# EAGLE design SMRT_CLK (EAGLE 9.3.0)
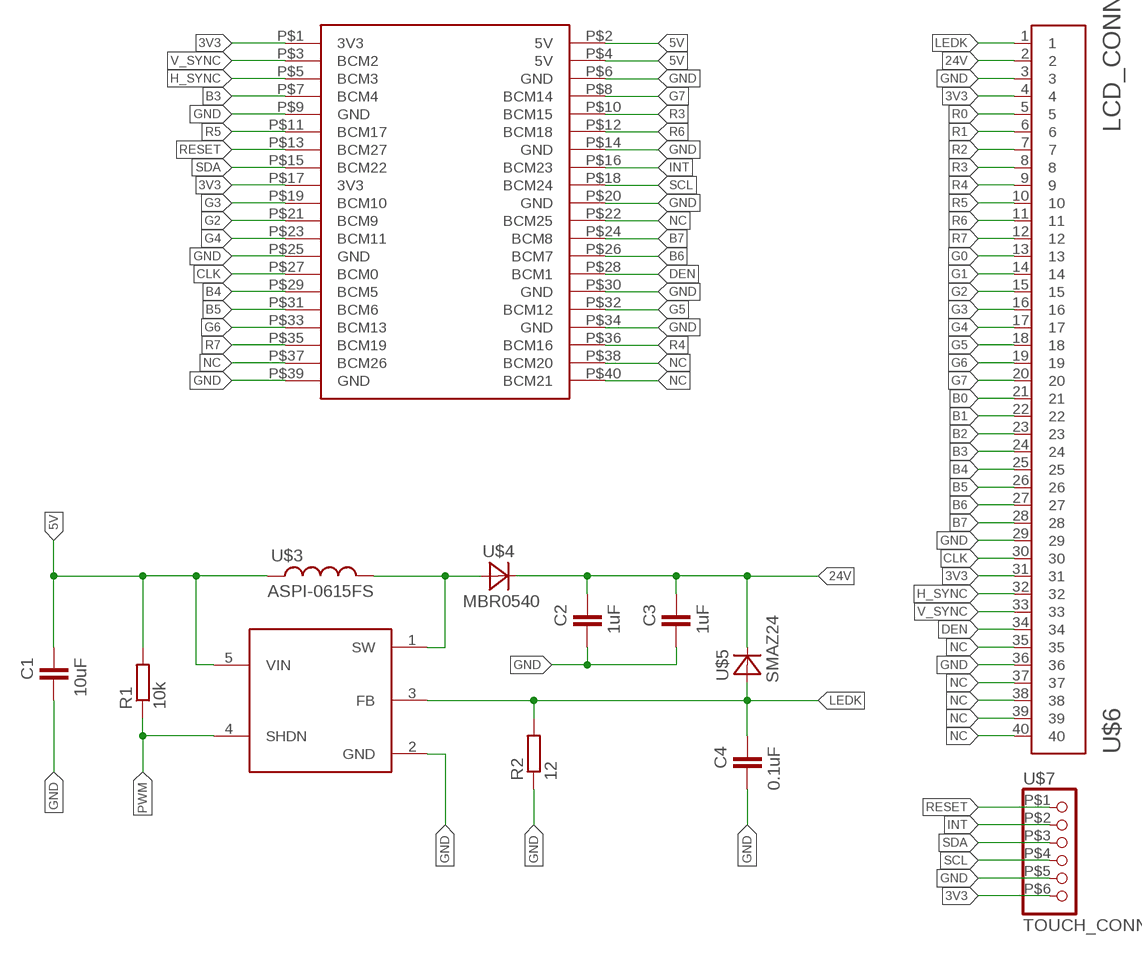
[diagram p0: schematic, sheet 1]

## Parts
C1  10uF  C-EUC0805  [C0805]
C2  1uF  C-EUC0805  [C0805]
C3  1uF  C-EUC0805  [C0805]
C4  0.1uF  C-EUC0805  [C0805]
R1  10k  R-EU_R0805  [R0805]
R2  12  R-EU_R0805  [R0805]
U$1  SMRT_CLK  [FULL_BOARD]
U$2  FAN5333BSX  [SOT23-5]
U$3  ASPI-0615FS  [CUST_IND]
U$4  MBR0540  [SOD-123_MINI-SMA]
U$5  SMAZ24  [DO-214AC]
U$6  LCD_CONN  [4-1734839-0]
U$7  TOUCH_CONN  [052207]

## Nets
3V3: U$1.P$1(3V3) U$1.P$17(3V3) U$6.4 U$6.31 U$7.P$6
5V: C1.2 R1.2 U$1.P$2(5V) U$1.P$4(5V) U$2.5(VIN) U$3.P$1
24V: C2.2 C3.2 U$4.C U$5.C U$6.2
B0: U$6.21
B1: U$6.22
B2: U$6.23
B3: U$1.P$7(BCM4) U$6.24
B4: U$1.P$29(BCM5) U$6.25
B5: U$1.P$31(BCM6) U$6.26
B6: U$1.P$26(BCM7) U$6.27
B7: U$1.P$24(BCM8) U$6.28
CLK: U$1.P$27(BCM0) U$6.30
DEN: U$1.P$28(BCM1) U$6.34
G0: U$6.13
G1: U$6.14
G2: U$1.P$21(BCM9) U$6.15
G3: U$1.P$19(BCM10) U$6.16
G4: U$1.P$23(BCM11) U$6.17
G5: U$1.P$32(BCM12) U$6.18
G6: U$1.P$33(BCM13) U$6.19
G7: U$1.P$8(BCM14) U$6.20
GND: C1.1 C2.1 C3.1 C4.1 R2.1 U$1.P$6(GND) U$1.P$9(GND) U$1.P$14(GND) U$1.P$20(GND) U$1.P$25(GND) U$1.P$30(GND) U$1.P$34(GND) U$1.P$39(GND) U$2.2(GND) U$6.3 U$6.29 U$6.36 U$7.P$5
H_SYNC: U$1.P$5(BCM3) U$6.32
INT: U$1.P$16(BCM23) U$7.P$2
LEDK: C4.2 R2.2 U$2.3(FB) U$5.A U$6.1
N$1: U$2.1(SW) U$3.P$2 U$4.A
NC: U$1.P$22(BCM25) U$1.P$37(BCM26) U$1.P$38(BCM20) U$1.P$40(BCM21) U$6.35 U$6.37 U$6.38 U$6.39 U$6.40
PWM: R1.1 U$2.4(SHDN)
R0: U$6.5
R1: U$6.6
R2: U$6.7
R3: U$1.P$10(BCM15) U$6.8
R4: U$1.P$36(BCM16) U$6.9
R5: U$1.P$11(BCM17) U$6.10
R6: U$1.P$12(BCM18) U$6.11
R7: U$1.P$35(BCM19) U$6.12
RESET: U$1.P$13(BCM27) U$7.P$1
SCL: U$1.P$18(BCM24) U$7.P$4
SDA: U$1.P$15(BCM22) U$7.P$3
V_SYNC: U$1.P$3(BCM2) U$6.33

## Library data of the parts
C1-C4 = rcl:C-EU: CAPACITOR, European symbol; SPICEPREFIX: C
R1 R2 = resistor:R-EU_: RESISTOR, European symbol
U$1 = rpi_zero_w:SMRT_CLK
U$2 = screen_parts:FAN5333BSX
U$3 = screen_parts:ASPI-0615FS
U$4 = screen_parts:MBR0540
U$5 = screen_parts:SMAZ24
U$6 = screen_parts:LCD_CONN
U$7 = screen_parts:TOUCH_CONN

## Board
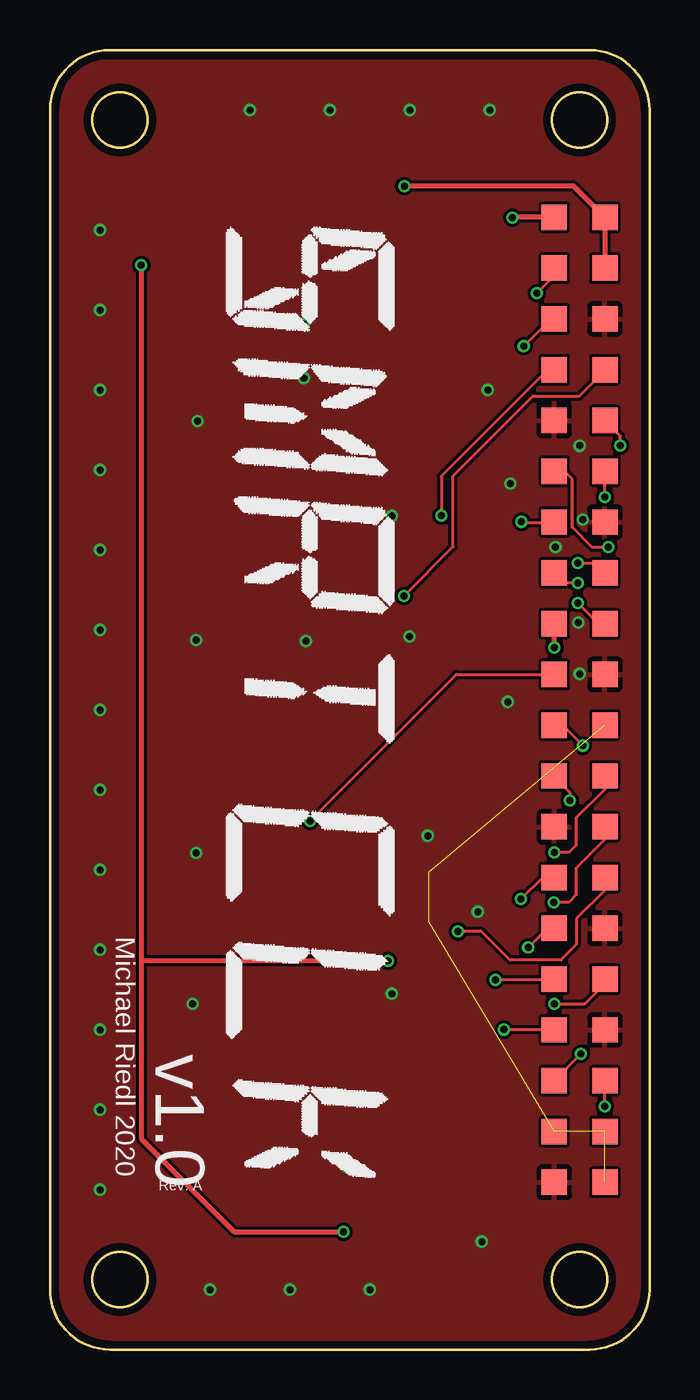
[diagram p1: board, top side]
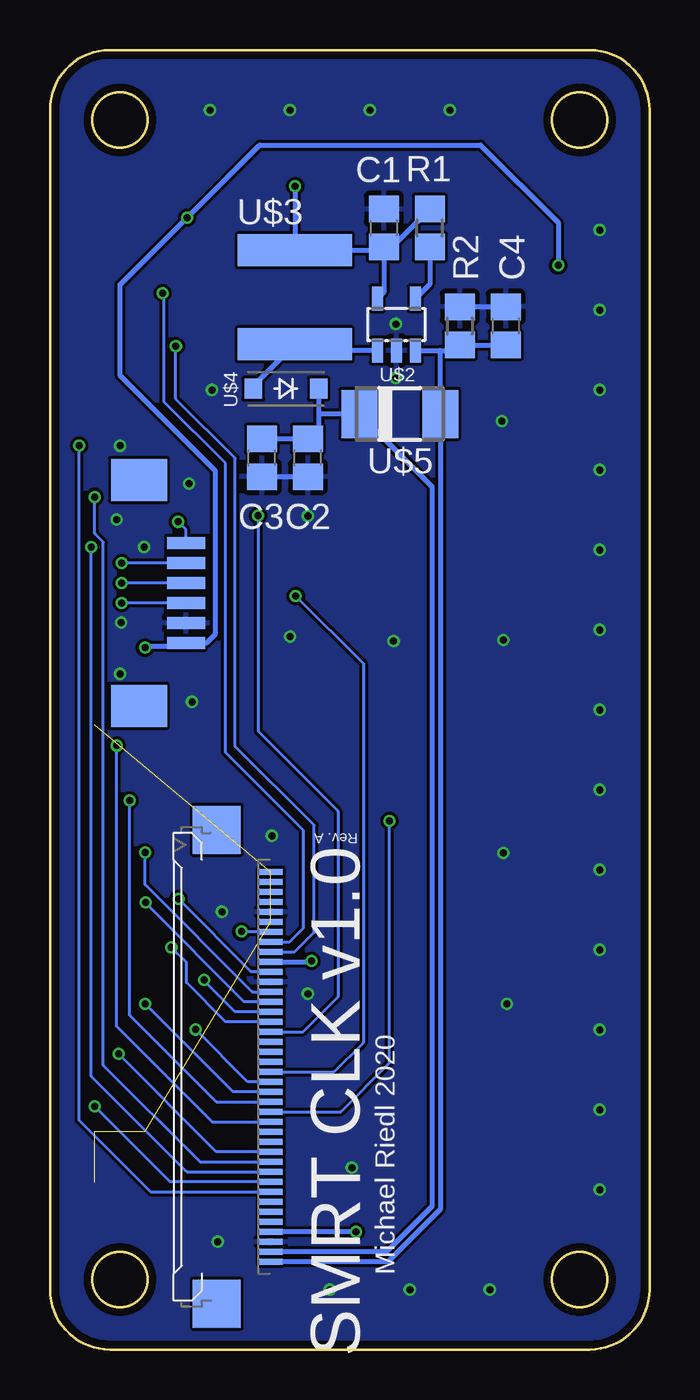
[diagram p2: board, bottom side, seen from below]

Size 30 x 65 mm. Coordinates in mm from the lower left corner, seen from the top.
Copper layers (1*16): Top 0.035559375mm / dielectric 1.6mm / Bottom 0.035559375mm
Design rules "default": minimum track width 6mil, minimum drill 10mil, track to track 6mil, track to pad 6mil, pad to pad 6mil, via to via 6mil, smd to smd 6mil, copper to edge 15mil, drill to drill 6mil, minimum pad ring 5mil, minimum via ring 5mil, stop-mask expansion 2.5mil, vias tented up to drill 15mil, thermal gap 10mil

### Footprints (pad centres in the part's own frame; a part is rotated, then mirrored left to right if it is on the bottom)
C0805 = smd 1.3 x 1.5: 1 -0.95,0; 2 0.95,0
R0805 = smd 1.3 x 1.5: 1 -0.95,0; 2 0.95,0
FULL_BOARD = smd 1.27 x 1.27: P$1 -24.13,10.23; P$2 -24.13,12.77; P$3 -21.59,10.23; P$4 -21.59,12.77; P$5 -19.05,10.23; P$6 -19.05,12.77; P$7 -16.51,10.23; P$8 -16.51,12.77; P$9 -13.97,10.23; P$10 -13.97,12.77; P$11 -11.43,10.23; P$12 -11.43,12.77; P$13 -8.89,10.23; P$14 -8.89,12.77; P$15 -6.35,10.23; P$16 -6.35,12.77; P$17 -3.81,10.23; P$18 -3.81,12.77; P$19 -1.27,10.23; P$20 -1.27,12.77; P$21 1.27,10.23; P$22 1.27,12.77; P$23 3.81,10.23; P$24 3.81,12.77; P$25 6.35,10.23; P$26 6.35,12.77; P$27 8.89,10.23; P$28 8.89,12.77; P$29 11.43,10.23; P$30 11.43,12.77; P$31 13.97,10.23; P$32 13.97,12.77; P$33 16.51,10.23; P$34 16.51,12.77; P$35 19.05,10.23; P$36 19.05,12.77; P$37 21.59,10.23; P$38 21.59,12.77; P$39 24.13,10.23; P$40 24.13,12.77
SOT23-5 = smd 0.55 x 1.2: 1 -0.95,-1.3; 2 0,-1.3; 3 0.95,-1.3; 4 0.95,1.3; 5 -0.95,1.3
CUST_IND = smd 1.6 x 5.7: P$1 -2.35,0; P$2 2.35,0
SOD-123_MINI-SMA = smd 0.88 x 1.02: A 1.635,0; C -1.635,0
DO-214AC = smd 1.8 x 2.4: A 2.025,0; C -2.025,0
4-1734839-0 = smd 0.3 x 1.2: 1 -9.75,-2.54; 2 -9.25,-2.54; 3 -8.75,-2.54; 4 -8.25,-2.54; 5 -7.75,-2.54; 6 -7.25,-2.54; 7 -6.75,-2.54; 8 -6.25,-2.54; 9 -5.75,-2.54; 10 -5.25,-2.54; 11 -4.75,-2.54; 12 -4.25,-2.54; 13 -3.75,-2.54; 14 -3.25,-2.54; 15 -2.75,-2.54; 16 -2.25,-2.54; 17 -1.75,-2.54; 18 -1.25,-2.54; 19 -0.75,-2.54; 20 -0.25,-2.54; 21 0.25,-2.54; 22 0.75,-2.54; 23 1.25,-2.54; 24 1.75,-2.54; 25 2.25,-2.54; 26 2.75,-2.54; 27 3.25,-2.54; 28 3.75,-2.54; 29 4.25,-2.54; 30 4.75,-2.54; 31 5.25,-2.54; 32 5.75,-2.54; 33 6.25,-2.54; 34 6.75,-2.54; 35 7.25,-2.54; 36 7.75,-2.54; 37 8.25,-2.54; 38 8.75,-2.54; 39 9.25,-2.54; 40 9.75,-2.54 | smd 2.4 x 2.4: M1 11.85,0.16; M2 -11.85,0.16
052207 = smd 0.6 x 1.9: P$1 -2.5,0; P$2 -1.5,0; P$3 -0.5,0; P$4 0.5,0; P$5 1.5,0; P$6 2.5,0 | smd 2.1 x 2.8: P$7 -5.65,-2.35; P$8 5.65,-2.35

### Placement (x,y rotation side)
C1  13.3,56.1 270 bottom
C2  17.1,44.6 90 bottom
C3  19.4,44.6 90 bottom
C4  7.2,51.2 270 bottom
R1  11,56.1 90 bottom
R2  9.5,51.2 270 bottom
U$1  15,32.5 270 top
U$2  12.67,51.27 0 bottom
U$3  17.75,52.63 270 bottom
U$4  18.19,48.06 180 bottom
U$5  12.5,46.8 0 bottom
U$6  21.5,14.15 90 bottom
U$7  23.2,37.85 270 bottom

### Tracks (layer width: path | path; a pad name or v marks a point on that pad's centre or on a via)
3V3  (via drill 0.35)
  Top 0.254: U$1.P$1 23.15,56.63 v23.14,56.62 | v14.68,5.89 9.22,5.89 4.57,10.54 4.57,19.41 | U$1.P$17 25.2,36.28 25.25,36.23 v25.25,35.1 | v4.57,54.23 4.57,19.41 | v16.92,19.43 4.6,19.43 4.57,19.41
  Bottom 0.254: v14.68,5.89 U$6.4 | v4.57,54.23 4.57,56.36 8.46,60.25 19.51,60.25 v23.14,56.62 26.49,53.27 26.49,48.72 21.74,43.97 21.74,35.76 22.16,35.34 23.19,35.34 U$7.P$6 23.37,35.18 25.17,35.18 v25.25,35.1 | U$6.31 16.95,19.4 v16.92,19.43
5V  (via drill 0.35)
  Top 0.254: v17.73,58.19 26.21,58.19 U$1.P$2 U$1.P$4
  Bottom 0.254: v17.73,58.19 17.73,55 U$3.P$1 13.47,54.98 C1.2 | C1.2 12.9,55.15 R1.2 | C1.2 13.3,52.89 U$2.5
24V
  Bottom 0.254: U$4.C 16.55,46.71 | 16.55,46.71 16.55,46.09 C2.2 C3.2 | 16.55,46.71 16.47,46.8 U$5.C 10.88,43.16 10.88,7.17 13.17,4.88 18.94,4.88 U$6.2
B3  (via drill 0.35)
  Top 0.152: U$1.P$7 24.91,49.01 19.58,43.69 v19.58,41.71
  Bottom 0.152: v19.58,41.71 19.58,30.93 15.59,26.94 15.59,17.63 17.33,15.89 U$6.24
B4  (via drill 0.35)
  Top 0.152: v23.93,20.12 24.88,21.07 U$1.P$29
  Bottom 0.152: v23.93,20.12 23.17,19.36 23.17,18.36 21.22,16.4 U$6.25
B5  (via drill 0.35)
  Top 0.152: U$1.P$31 25.18,18.48 v22.29,18.48
  Bottom 0.152: v22.29,18.48 22.29,18.45 20.74,16.9 U$6.26
B6  (via drill 0.35)
  Top 0.152: U$1.P$26 27.77,25.52 26.35,24.09 26.35,22.75 25.96,22.36 v25.22,22.36
  Bottom 0.152: U$6.27 20.28,17.4 25.22,22.34 v25.22,22.36
B7  (via drill 0.35)
  Top 0.152: U$1.P$24 27.77,28.02 26.35,26.6 26.35,25.24 25.98,24.88 v25.26,24.88 v25.25,24.87
  Bottom 0.152: U$6.28 19.88,17.89 25.25,23.26 v25.25,24.87
CLK  (via drill 0.35)
  Top 0.152: v23.57,22.53 24.65,23.61 U$1.P$27
  Bottom 0.152: U$6.30 19.94,18.9 v23.57,22.53
DEN  (via drill 0.35)
  Top 0.152: U$1.P$28 27.77,22.98 26.35,21.55 26.35,20.26 25.57,19.48 23.02,19.48 21.59,20.9 v20.42,20.9
  Bottom 0.152: v20.42,20.9 U$6.34
G2  (via drill 0.35)
  Top 0.152: v26.67,30.2 25.64,31.23 U$1.P$21
  Bottom 0.152: U$6.15 21.89,11.39 26.67,16.17 v26.67,30.2
G3  (via drill 0.35)
  Top 0.152: v13.01,26.44 20.33,33.77 U$1.P$19
  Bottom 0.152: U$6.16 15.45,11.89 13.03,14.31 13.03,26.42 v13.01,26.44
G4  (via drill 0.35)
  Top 0.152: v26.01,27.46 26.01,27.86 25.23,28.64 U$1.P$23
  Bottom 0.152: U$6.17 21.69,12.39 26.01,16.72 v26.01,27.46
G5  (via drill 0.35)
  Top 0.152: v25.25,17.3 26.72,17.3 26.75,17.27 27.77,18.3 U$1.P$32
  Bottom 0.152: U$6.18 20.85,12.9 v25.25,17.3
G6  (via drill 0.35)
  Top 0.152: v22.71,16 25.22,16 U$1.P$33
  Bottom 0.152: U$6.19 20.11,13.4 v22.71,16
G7  (via drill 0.35)
  Top 0.152: v17.7,37.69 20.17,40.16 20.17,43.69 24.17,47.69 26.49,47.69 27.77,48.97 U$1.P$8
  Bottom 0.152: U$6.20 15.78,13.89 14.32,15.35 14.32,34.31 v17.7,37.69
GND  (via drill 0.35)
  Bottom 0.254: C4.1 R2.1 | C2.1 C3.1
  other vias: 26.5,45.2 22,62 18,62 14,62 10,62 26.5,33.8 22.9,32.4 21.4,21.9 17.1,17.8 14.9,9.1 21.6,5.4 16,3 12,3 8,3 2.5,8 2.5,12 2.5,16 2.5,20 2.5,24 2.5,28 2.5,32 2.5,36 2.5,40 2.5,44 2.5,48 2.5,52 12.7,51.3 12.7,48.6 21.9,48 17.1,41.7 18.9,25.7 2.5,56 12.8,35.43 17.98,35.66 7.32,35.48 7.32,24.84 7.14,17.3 7.39,46.43 26.44,36.37 23.04,43.31 25.3,40.13 26.67,41.5
  pour Top: -0.81,65.76 -0.81,-0.72 30.92,-0.72 30.92,65.76
  pour Bottom: -1.44,66.22 -1.44,-1.15 31.51,-1.15 31.51,66.22
H_SYNC  (via drill 0.35)
  Top 0.152: v23.7,50.19 25.06,51.55 U$1.P$5
  Bottom 0.152: v23.7,50.19 23.7,47.55 20.73,44.58 20.73,30.18 16.79,26.23 16.79,20.86 17.75,19.89 U$6.32
INT  (via drill 0.35)
  Top 0.152: v26.42,39.34 27.28,39.34 U$1.P$16
  Bottom 0.152: U$7.P$2 v26.41,39.35 v26.42,39.34
LEDK
  Bottom 0.254: U$2.3 10.46,49.97 | 10.46,49.97 9.78,49.97 R2.2 C4.2 | 10.46,49.97 10.47,49.96 U$5.A 10.47,7 13.08,4.39 U$6.1
N$1
  Bottom 0.254: U$2.1 17.44,49.97 U$3.P$2 19.82,48.2 U$4.A
NC  (8 unrouted)
PWM
  Bottom 0.254: R1.1 11,53.29 U$2.4
R3  (via drill 0.35)
  Top 0.152: v28.54,45.21 28.54,45.7 U$1.P$10
  Bottom 0.152: U$6.8 24.96,7.89 28.54,11.47 v28.54,45.21
R4  (via drill 0.35)
  Top 0.152: v27.76,12.17 U$1.P$36
  Bottom 0.152: U$6.9 24,8.4 v27.76,12.17
R5  (via drill 0.35)
  Top 0.152: v27.94,40.13 27.92,40.12 27.14,40.12 26.14,41.12 26.14,43.54 25.74,43.93 U$1.P$11
  Bottom 0.152: U$6.10 23.16,8.89 27.94,13.67 v27.94,40.13
R6  (via drill 0.35)
  Top 0.152: v27.76,42.65 U$1.P$12
  Bottom 0.152: U$6.11 22.5,9.39 27.33,14.22 27.33,40.38 27.76,40.82 v27.76,42.65
R7  (via drill 0.35)
  Top 0.152: v26.57,14.78 U$1.P$35
  Bottom 0.152: U$6.12 21.68,9.9 v26.57,14.78
RESET  (via drill 0.35)
  Top 0.152: U$1.P$13 25.23,41.36 23.64,41.36 v23.6,41.4
  Bottom 0.152: U$7.P$1 23.2,41.01 v23.6,41.4
SCL  (via drill 0.35)
  Top 0.152: v26.42,37.34 27.44,36.31 U$1.P$18
  Bottom 0.152: U$7.P$4 26.41,37.35 v26.42,37.34
SDA  (via drill 0.35)
  Top 0.152: v26.42,38.33 25.78,38.33 25.26,38.85 U$1.P$15
  Bottom 0.152: U$7.P$3 26.39,38.35 v26.42,38.33
V_SYNC  (via drill 0.35)
  Top 0.152: U$1.P$3 25.23,53.7 v24.36,52.83
  Bottom 0.152: U$6.33 18.01,20.39 17.32,21.09 17.32,25.97 21.22,29.88 21.22,44.33 24.31,47.42 24.31,52.78 v24.36,52.83

### Text on the board
tPlace: Michael Riedl 2020 | v1.0 | Rev. A
bPlace: Rev. A | SMRT CLK v1.0 | Michael Riedl 2020